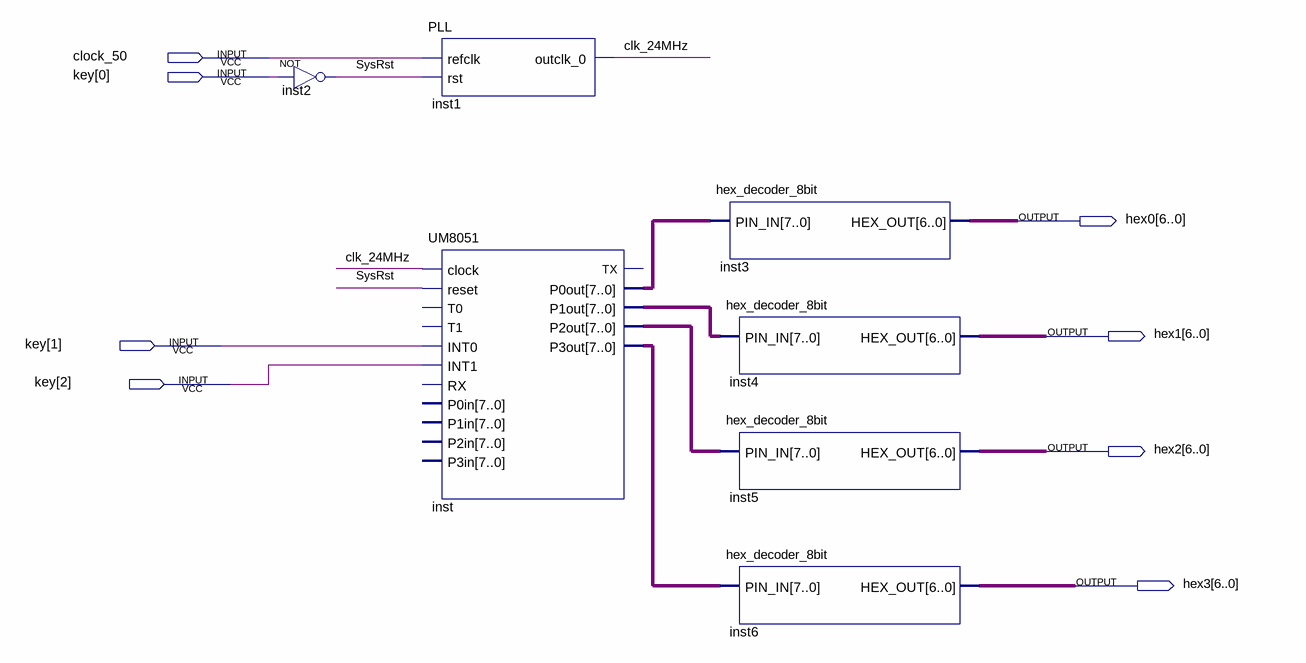
[diagram p0: schematic sheet]
// Quartus schematic lab2.bdf as structural Verilog: 7 symbols, 8 pins
module lab2 (
  input  clock_50,
  input  [2:0] key,
  output [6:0] hex0,
  output [6:0] hex1,
  output [6:0] hex2,
  output [6:0] hex3
);

  wire clk_24MHz, SysRst;
  wire [7:0] inst_p0out, inst_p1out, inst_p2out, inst_p3out;

  not inst2 (SysRst, key[0]);
  PLL inst1 (.refclk(clock_50), .rst(SysRst), .outclk_0(clk_24MHz));
  UM8051 inst (
    .clock(clk_24MHz), .reset(SysRst), .INT0(key[1]), .INT1(key[2]), .P0out(inst_p0out), .P1out(inst_p1out),
    .P2out(inst_p2out), .P3out(inst_p3out));  // open: T0, T1, RX, P0in, P1in, P2in, P3in, TX
  hex_decoder_8bit inst3 (.PIN_IN(inst_p0out), .HEX_OUT(hex0));
  hex_decoder_8bit inst4 (.PIN_IN(inst_p1out), .HEX_OUT(hex1));
  hex_decoder_8bit inst5 (.PIN_IN(inst_p2out), .HEX_OUT(hex2));
  hex_decoder_8bit inst6 (.PIN_IN(inst_p3out), .HEX_OUT(hex3));
endmodule
